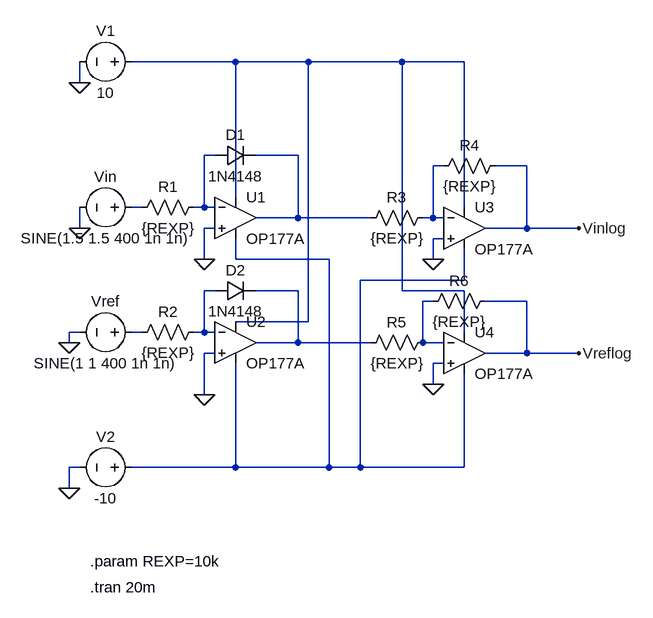
[diagram p0: schematic log_stage.asc]
log_stage.asc, the LTspice schematic file:
Version 4.1
SHEET 1 900 712
WIRE 272 -112 112 -112
WIRE 384 -112 272 -112
WIRE 528 -112 384 -112
WIRE 624 -112 528 -112
WIRE 32 -80 32 -112
WIRE 240 32 224 32
WIRE 368 32 304 32
WIRE 592 48 576 48
WIRE 720 48 672 48
WIRE 272 96 272 -112
WIRE 128 112 112 112
WIRE 224 112 224 32
WIRE 224 112 208 112
WIRE 240 112 224 112
WIRE 624 112 624 -112
WIRE 368 128 368 32
WIRE 368 128 304 128
WIRE 480 128 368 128
WIRE 576 128 576 48
WIRE 576 128 560 128
WIRE 592 128 576 128
WIRE 32 144 32 112
WIRE 240 144 224 144
WIRE 720 144 720 48
WIRE 720 144 656 144
WIRE 800 144 720 144
WIRE 592 160 576 160
WIRE 224 192 224 144
WIRE 272 192 272 160
WIRE 416 192 272 192
WIRE 576 192 576 160
WIRE 624 224 624 176
WIRE 624 224 464 224
WIRE 240 240 224 240
WIRE 368 240 304 240
WIRE 528 240 528 -112
WIRE 624 240 528 240
WIRE 576 256 560 256
WIRE 720 256 656 256
WIRE 384 288 384 -112
WIRE 384 288 272 288
WIRE 32 304 16 304
WIRE 128 304 112 304
WIRE 224 304 224 240
WIRE 224 304 208 304
WIRE 240 304 224 304
WIRE 624 304 624 240
WIRE 16 320 16 304
WIRE 368 320 368 240
WIRE 368 320 304 320
WIRE 480 320 368 320
WIRE 560 320 560 256
WIRE 592 320 560 320
WIRE 240 336 224 336
WIRE 720 336 720 256
WIRE 720 336 656 336
WIRE 800 336 720 336
WIRE 592 352 576 352
WIRE 576 384 576 352
WIRE 224 400 224 336
WIRE 32 512 16 512
WIRE 272 512 272 352
WIRE 272 512 112 512
WIRE 416 512 416 192
WIRE 416 512 272 512
WIRE 464 512 464 224
WIRE 464 512 416 512
WIRE 624 512 624 368
WIRE 624 512 464 512
WIRE 16 544 16 512
FLAG 32 144 0
FLAG 224 192 0
FLAG 16 320 0
FLAG 224 400 0
FLAG 576 192 0
FLAG 576 384 0
FLAG 800 144 Vinlog
FLAG 800 336 Vreflog
FLAG 32 -80 0
FLAG 16 544 0
SYMBOL voltage 128 112 R90
WINDOW 0 -32 56 VBottom 2
WINDOW 3 32 56 VTop 2
WINDOW 123 0 0 Left 0
WINDOW 39 0 0 Left 0
SYMATTR InstName Vin
SYMATTR Value SINE(1.5 1.5 400 1n 1n)
SYMBOL OpAmps\\OP177A 272 64 R0
SYMATTR InstName U1
SYMBOL res 224 96 R90
WINDOW 0 0 56 VBottom 2
WINDOW 3 32 56 VTop 2
SYMATTR InstName R1
SYMATTR Value {REXP}
SYMBOL diode 240 48 R270
WINDOW 0 32 32 VTop 2
WINDOW 3 0 32 VBottom 2
SYMATTR InstName D1
SYMATTR Value 1N4148
SYMBOL OpAmps\\OP177A 272 256 R0
SYMATTR InstName U2
SYMBOL voltage 128 304 R90
WINDOW 0 -32 56 VBottom 2
WINDOW 3 32 56 VTop 2
WINDOW 123 0 0 Left 0
WINDOW 39 0 0 Left 0
SYMATTR InstName Vref
SYMATTR Value SINE(1 1 400 1n 1n)
SYMBOL res 224 288 R90
WINDOW 0 0 56 VBottom 2
WINDOW 3 32 56 VTop 2
SYMATTR InstName R2
SYMATTR Value {REXP}
SYMBOL diode 240 256 R270
WINDOW 0 32 32 VTop 2
WINDOW 3 0 32 VBottom 2
SYMATTR InstName D2
SYMATTR Value 1N4148
SYMBOL OpAmps\\OP177A 624 80 R0
SYMATTR InstName U3
SYMBOL res 576 112 R90
WINDOW 0 0 56 VBottom 2
WINDOW 3 32 56 VTop 2
SYMATTR InstName R3
SYMATTR Value {REXP}
SYMBOL res 688 32 R90
WINDOW 0 0 56 VBottom 2
WINDOW 3 32 56 VTop 2
SYMATTR InstName R4
SYMATTR Value {REXP}
SYMBOL OpAmps\\OP177A 624 272 R0
SYMATTR InstName U4
SYMBOL res 576 304 R90
WINDOW 0 0 56 VBottom 2
WINDOW 3 32 56 VTop 2
SYMATTR InstName R5
SYMATTR Value {REXP}
SYMBOL res 672 240 R90
WINDOW 0 0 56 VBottom 2
WINDOW 3 32 56 VTop 2
SYMATTR InstName R6
SYMATTR Value {REXP}
SYMBOL voltage 128 -112 R90
WINDOW 0 -32 56 VBottom 2
WINDOW 3 32 56 VTop 2
WINDOW 123 0 0 Left 0
WINDOW 39 0 0 Left 0
SYMATTR InstName V1
SYMATTR Value 10
SYMBOL voltage 128 512 R90
WINDOW 0 -32 56 VBottom 2
WINDOW 3 32 56 VTop 2
WINDOW 123 0 0 Left 0
WINDOW 39 0 0 Left 0
SYMATTR InstName V2
SYMATTR Value -10
TEXT 48 656 Left 2 !.param REXP=10k
TEXT 48 696 Left 2 !.tran 20m

The netlist it stands for:
* log_stage.asc
Vin N005 0 SINE(1.5 1.5 400 1n 1n)
X§U1 0 N002 N001 N006 N003 OP177A  ; pins In+ In- V+ V- OUT
R1 N002 N005 {REXP}
D1 N002 N003 1N4148
X§U2 0 N007 N001 N006 N008 OP177A  ; pins In+ In- V+ V- OUT
Vref N010 0 SINE(1 1 400 1n 1n)
R2 N007 N010 {REXP}
D2 N007 N008 1N4148
X§U3 0 N004 N001 N006 Vinlog OP177A  ; pins In+ In- V+ V- OUT
R3 N004 N003 {REXP}
R4 Vinlog N004 {REXP}
X§U4 0 N009 N001 N006 Vreflog OP177A  ; pins In+ In- V+ V- OUT
R5 N009 N008 {REXP}
R6 Vreflog N009 {REXP}
V1 N001 0 10
V2 N006 0 -10
.model D D
.lib standard.dio
.param REXP=10k
.tran 20m
.backanno
.end